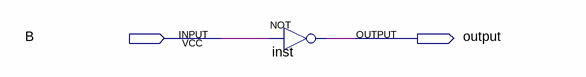
[diagram p0: schematic sheet]
// Quartus schematic InversorB.bdf as structural Verilog: 1 symbols, 2 pins
module InversorB (
  input  B,
  output \output 
);

  not inst (\output , B);
endmodule
